# EAGLE design usb_midi_12_gate_16_cv_interface (EAGLE 8.0.0)
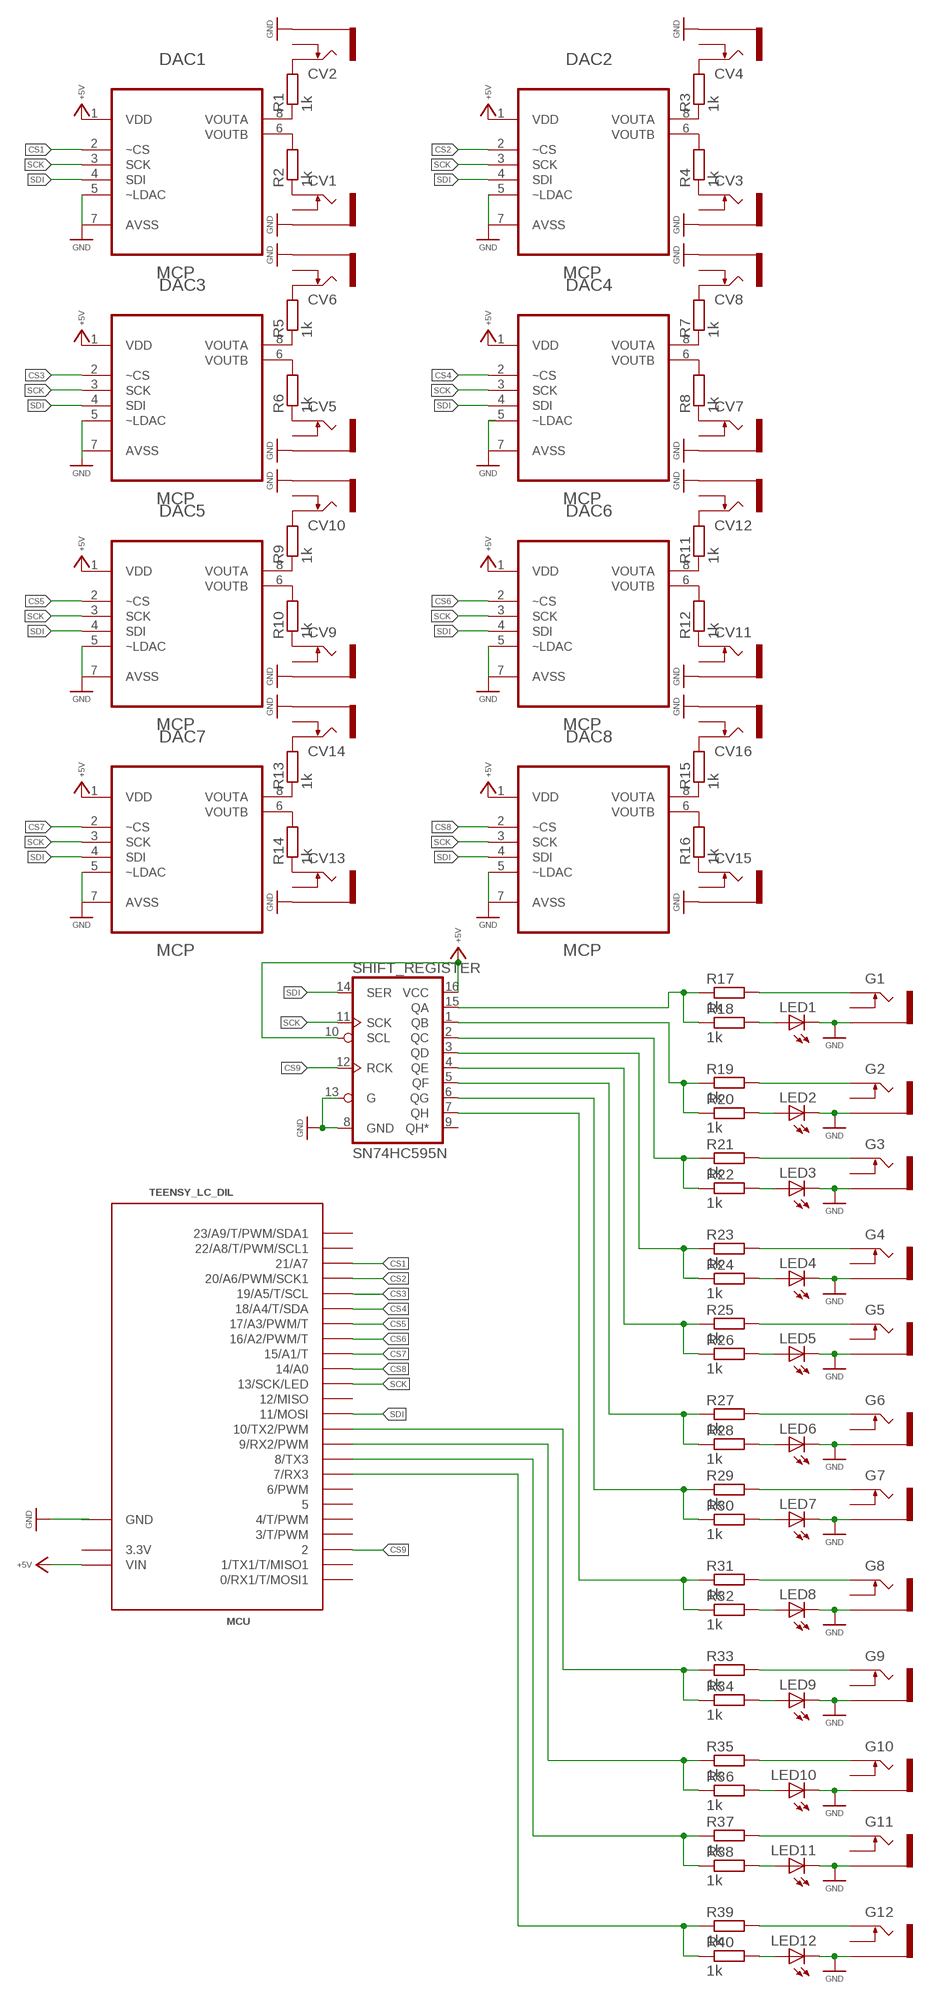
[diagram p0: schematic, sheet 1]

## Parts
CV1  THONKICONNNEW  [WQP-PJ301M-12_JACK]
CV2  THONKICONNNEW  [WQP-PJ301M-12_JACK]
CV3  THONKICONNNEW  [WQP-PJ301M-12_JACK]
CV4  THONKICONNNEW  [WQP-PJ301M-12_JACK]
CV5  THONKICONNNEW  [WQP-PJ301M-12_JACK]
CV6  THONKICONNNEW  [WQP-PJ301M-12_JACK]
CV7  THONKICONNNEW  [WQP-PJ301M-12_JACK]
CV8  THONKICONNNEW  [WQP-PJ301M-12_JACK]
CV9  THONKICONNNEW  [WQP-PJ301M-12_JACK]
CV10  THONKICONNNEW  [WQP-PJ301M-12_JACK]
CV11  THONKICONNNEW  [WQP-PJ301M-12_JACK]
CV12  THONKICONNNEW  [WQP-PJ301M-12_JACK]
CV13  THONKICONNNEW  [WQP-PJ301M-12_JACK]
CV14  THONKICONNNEW  [WQP-PJ301M-12_JACK]
CV15  THONKICONNNEW  [WQP-PJ301M-12_JACK]
CV16  THONKICONNNEW  [WQP-PJ301M-12_JACK]
DAC1  MCP  MCP4822-E/P  [DIP254P762X432-8]
DAC2  MCP  MCP4822-E/P  [DIP254P762X432-8]
DAC3  MCP  MCP4822-E/P  [DIP254P762X432-8]
DAC4  MCP  MCP4822-E/P  [DIP254P762X432-8]
DAC5  MCP  MCP4822-E/P  [DIP254P762X432-8]
DAC6  MCP  MCP4822-E/P  [DIP254P762X432-8]
DAC7  MCP  MCP4822-E/P  [DIP254P762X432-8]
DAC8  MCP  MCP4822-E/P  [DIP254P762X432-8]
G1  THONKICONNNEW  [WQP-PJ301M-12_JACK]
G2  THONKICONNNEW  [WQP-PJ301M-12_JACK]
G3  THONKICONNNEW  [WQP-PJ301M-12_JACK]
G4  THONKICONNNEW  [WQP-PJ301M-12_JACK]
G5  THONKICONNNEW  [WQP-PJ301M-12_JACK]
G6  THONKICONNNEW  [WQP-PJ301M-12_JACK]
G7  THONKICONNNEW  [WQP-PJ301M-12_JACK]
G8  THONKICONNNEW  [WQP-PJ301M-12_JACK]
G9  THONKICONNNEW  [WQP-PJ301M-12_JACK]
G10  THONKICONNNEW  [WQP-PJ301M-12_JACK]
G11  THONKICONNNEW  [WQP-PJ301M-12_JACK]
G12  THONKICONNNEW  [WQP-PJ301M-12_JACK]
LED1  LED3MM  [LED3MM]
LED2  LED3MM  [LED3MM]
LED3  LED3MM  [LED3MM]
LED4  LED3MM  [LED3MM]
LED5  LED3MM  [LED3MM]
LED6  LED3MM  [LED3MM]
LED7  LED3MM  [LED3MM]
LED8  LED3MM  [LED3MM]
LED9  LED3MM  [LED3MM]
LED10  LED3MM  [LED3MM]
LED11  LED3MM  [LED3MM]
LED12  LED3MM  [LED3MM]
MCU  TEENSY_LC_DIL  [TEENSY_3.0-3.2&LC_DIL]
R1  1k  RESISTOR10MM_RESISTOR  [10MM_RESISTOR]
R2  1k  RESISTOR10MM_RESISTOR  [10MM_RESISTOR]
R3  1k  RESISTOR10MM_RESISTOR  [10MM_RESISTOR]
R4  1k  RESISTOR10MM_RESISTOR  [10MM_RESISTOR]
R5  1k  RESISTOR10MM_RESISTOR  [10MM_RESISTOR]
R6  1k  RESISTOR10MM_RESISTOR  [10MM_RESISTOR]
R7  1k  RESISTOR10MM_RESISTOR  [10MM_RESISTOR]
R8  1k  RESISTOR10MM_RESISTOR  [10MM_RESISTOR]
R9  1k  RESISTOR10MM_RESISTOR  [10MM_RESISTOR]
R10  1k  RESISTOR10MM_RESISTOR  [10MM_RESISTOR]
R11  1k  RESISTOR10MM_RESISTOR  [10MM_RESISTOR]
R12  1k  RESISTOR10MM_RESISTOR  [10MM_RESISTOR]
R13  1k  RESISTOR10MM_RESISTOR  [10MM_RESISTOR]
R14  1k  RESISTOR10MM_RESISTOR  [10MM_RESISTOR]
R15  1k  RESISTOR10MM_RESISTOR  [10MM_RESISTOR]
R16  1k  RESISTOR10MM_RESISTOR  [10MM_RESISTOR]
R17  1k  RESISTOR10MM_RESISTOR  [10MM_RESISTOR]
R18  1k  RESISTOR10MM_RESISTOR  [10MM_RESISTOR]
R19  1k  RESISTOR10MM_RESISTOR  [10MM_RESISTOR]
R20  1k  RESISTOR10MM_RESISTOR  [10MM_RESISTOR]
R21  1k  RESISTOR10MM_RESISTOR  [10MM_RESISTOR]
R22  1k  RESISTOR10MM_RESISTOR  [10MM_RESISTOR]
R23  1k  RESISTOR10MM_RESISTOR  [10MM_RESISTOR]
R24  1k  RESISTOR10MM_RESISTOR  [10MM_RESISTOR]
R25  1k  RESISTOR10MM_RESISTOR  [10MM_RESISTOR]
R26  1k  RESISTOR10MM_RESISTOR  [10MM_RESISTOR]
R27  1k  RESISTOR10MM_RESISTOR  [10MM_RESISTOR]
R28  1k  RESISTOR10MM_RESISTOR  [10MM_RESISTOR]
R29  1k  RESISTOR10MM_RESISTOR  [10MM_RESISTOR]
R30  1k  RESISTOR10MM_RESISTOR  [10MM_RESISTOR]
R31  1k  RESISTOR10MM_RESISTOR  [10MM_RESISTOR]
R32  1k  RESISTOR10MM_RESISTOR  [10MM_RESISTOR]
R33  1k  RESISTOR10MM_RESISTOR  [10MM_RESISTOR]
R34  1k  RESISTOR10MM_RESISTOR  [10MM_RESISTOR]
R35  1k  RESISTOR10MM_RESISTOR  [10MM_RESISTOR]
R36  1k  RESISTOR10MM_RESISTOR  [10MM_RESISTOR]
R37  1k  RESISTOR10MM_RESISTOR  [10MM_RESISTOR]
R38  1k  RESISTOR10MM_RESISTOR  [10MM_RESISTOR]
R39  1k  RESISTOR10MM_RESISTOR  [10MM_RESISTOR]
R40  1k  RESISTOR10MM_RESISTOR  [10MM_RESISTOR]
SHIFT_REGISTER  SN74HC595N  74HC595N  [DIP16]

## Nets
+5V: DAC1.1(VDD) DAC2.1(VDD) DAC3.1(VDD) DAC4.1(VDD) DAC5.1(VDD) DAC6.1(VDD) DAC7.1(VDD) DAC8.1(VDD) MCU.VIN SHIFT_REGISTER.10(SCL) SHIFT_REGISTER.16(VCC)
CS1: DAC1.2(~CS) MCU.21/A7
CS2: DAC2.2(~CS) MCU.20/A6(20/A6/PWM/SCK1)
CS3: DAC3.2(~CS) MCU.19/A5(19/A5/T/SCL)
CS4: DAC4.2(~CS) MCU.18/A4(18/A4/T/SDA)
CS5: DAC5.2(~CS) MCU.17/A3(17/A3/PWM/T)
CS6: DAC6.2(~CS) MCU.16/A2(16/A2/PWM/T)
CS7: DAC7.2(~CS) MCU.15/A1(15/A1/T)
CS8: DAC8.2(~CS) MCU.14/A0
CS9: MCU.2 SHIFT_REGISTER.12(RCK)
GND: CV1.P$3_SLEEVE(SLEEVE) CV2.P$3_SLEEVE(SLEEVE) CV3.P$3_SLEEVE(SLEEVE) CV4.P$3_SLEEVE(SLEEVE) CV5.P$3_SLEEVE(SLEEVE) CV6.P$3_SLEEVE(SLEEVE) CV7.P$3_SLEEVE(SLEEVE) CV8.P$3_SLEEVE(SLEEVE) CV9.P$3_SLEEVE(SLEEVE) CV10.P$3_SLEEVE(SLEEVE) CV11.P$3_SLEEVE(SLEEVE) CV12.P$3_SLEEVE(SLEEVE) CV13.P$3_SLEEVE(SLEEVE) CV14.P$3_SLEEVE(SLEEVE) CV15.P$3_SLEEVE(SLEEVE) CV16.P$3_SLEEVE(SLEEVE) DAC1.5(~LDAC) DAC1.7(AVSS) DAC2.5(~LDAC) DAC2.7(AVSS) DAC3.7(AVSS) DAC4.7(AVSS) DAC5.5(~LDAC) DAC5.7(AVSS) DAC6.5(~LDAC) DAC6.7(AVSS) DAC7.5(~LDAC) DAC7.7(AVSS) DAC8.5(~LDAC) DAC8.7(AVSS) G1.P$3_SLEEVE(SLEEVE) G2.P$3_SLEEVE(SLEEVE) G3.P$3_SLEEVE(SLEEVE) G4.P$3_SLEEVE(SLEEVE) G5.P$3_SLEEVE(SLEEVE) G6.P$3_SLEEVE(SLEEVE) G7.P$3_SLEEVE(SLEEVE) G8.P$3_SLEEVE(SLEEVE) G9.P$3_SLEEVE(SLEEVE) G10.P$3_SLEEVE(SLEEVE) G11.P$3_SLEEVE(SLEEVE) G12.P$3_SLEEVE(SLEEVE) LED1.K(C) LED2.K(C) LED3.K(C) LED4.K(C) LED5.K(C) LED6.K(C) LED7.K(C) LED8.K(C) LED9.K(C) LED10.K(C) LED11.K(C) LED12.K(C) SHIFT_REGISTER.8(GND) SHIFT_REGISTER.13(G)
N$1: DAC1.6(VOUTB) R2.2
N$2: DAC1.8(VOUTA) R1.1
N$3: DAC2.8(VOUTA) R3.1
N$4: DAC2.6(VOUTB) R4.2
N$5: DAC3.8(VOUTA) R5.1
N$6: DAC3.6(VOUTB) R6.2
N$7: DAC4.8(VOUTA) R7.1
N$8: DAC4.6(VOUTB) R8.2
N$9: DAC5.8(VOUTA) R9.1
N$10: DAC5.6(VOUTB) R10.2
N$11: DAC6.8(VOUTA) R11.1
N$12: DAC6.6(VOUTB) R12.2
N$13: DAC7.8(VOUTA) R13.1
N$14: DAC7.6(VOUTB) R14.2
N$15: DAC8.8(VOUTA) R15.1
N$16: DAC8.6(VOUTB) R16.2
N$17: CV1.P$1_TIP(TIP) R2.1
N$18: CV2.P$1_TIP(TIP) R1.2
N$19: CV4.P$1_TIP(TIP) R3.2
N$20: CV3.P$1_TIP(TIP) R4.1
N$21: CV5.P$1_TIP(TIP) R6.1
N$22: CV6.P$1_TIP(TIP) R5.2
N$23: CV7.P$1_TIP(TIP) R8.1
N$24: CV8.P$1_TIP(TIP) R7.2
N$25: CV9.P$1_TIP(TIP) R10.1
N$26: CV10.P$1_TIP(TIP) R9.2
N$27: CV11.P$1_TIP(TIP) R12.1
N$28: CV12.P$1_TIP(TIP) R11.2
N$29: CV13.P$1_TIP(TIP) R14.1
N$30: CV14.P$1_TIP(TIP) R13.2
N$31: CV15.P$1_TIP(TIP) R16.1
N$32: CV16.P$1_TIP(TIP) R15.2
N$33: G9.P$1_TIP(TIP) R33.2
N$34: LED9.A R34.2
N$35: MCU.10(10/TX2/PWM) R33.1 R34.1
N$36: G10.P$1_TIP(TIP) R35.2
N$37: LED10.A R36.2
N$38: MCU.9(9/RX2/PWM) R35.1 R36.1
N$39: G11.P$1_TIP(TIP) R37.2
N$40: LED11.A R38.2
N$41: MCU.8(8/TX3) R37.1 R38.1
N$42: G12.P$1_TIP(TIP) R39.2
N$43: LED12.A R40.2
N$44: MCU.7(7/RX3) R39.1 R40.1
N$57: G1.P$1_TIP(TIP) R17.2
N$58: R17.1 R18.1 SHIFT_REGISTER.15(QA)
N$59: LED1.A R18.2
N$60: G2.P$1_TIP(TIP) R19.2
N$61: LED2.A R20.2
N$62: R19.1 R20.1 SHIFT_REGISTER.1(QB)
N$63: G3.P$1_TIP(TIP) R21.2
N$64: LED3.A R22.2
N$65: R21.1 R22.1 SHIFT_REGISTER.2(QC)
N$66: G4.P$1_TIP(TIP) R23.2
N$67: LED4.A R24.2
N$68: R23.1 R24.1 SHIFT_REGISTER.3(QD)
N$69: G5.P$1_TIP(TIP) R25.2
N$70: LED5.A R26.2
N$71: R25.1 R26.1 SHIFT_REGISTER.4(QE)
N$72: G6.P$1_TIP(TIP) R27.2
N$73: LED6.A R28.2
N$74: R27.1 R28.1 SHIFT_REGISTER.5(QF)
N$75: G7.P$1_TIP(TIP) R29.2
N$76: LED7.A R30.2
N$77: R29.1 R30.1 SHIFT_REGISTER.6(QG)
N$78: G8.P$1_TIP(TIP) R31.2
N$79: LED8.A R32.2
N$80: R31.1 R32.1 SHIFT_REGISTER.7(QH)
N$83: DAC3.5(~LDAC)
SCK: DAC1.3(SCK) DAC2.3(SCK) DAC3.3(SCK) DAC4.3(SCK) DAC5.3(SCK) DAC6.3(SCK) DAC7.3(SCK) DAC8.3(SCK) MCU.13(13/SCK/LED) SHIFT_REGISTER.11(SCK)
SDI: DAC1.4(SDI) DAC2.4(SDI) DAC3.4(SDI) DAC4.4(SDI) DAC5.4(SDI) DAC6.4(SDI) DAC7.4(SDI) DAC8.4(SDI) MCU.11(11/MOSI) SHIFT_REGISTER.14(SER)
Unconnected: CV1.P$2_SWITCH(SWITCH) CV2.P$2_SWITCH(SWITCH) CV3.P$2_SWITCH(SWITCH) CV4.P$2_SWITCH(SWITCH) CV5.P$2_SWITCH(SWITCH) CV6.P$2_SWITCH(SWITCH) CV7.P$2_SWITCH(SWITCH) CV8.P$2_SWITCH(SWITCH) CV9.P$2_SWITCH(SWITCH) CV10.P$2_SWITCH(SWITCH) CV11.P$2_SWITCH(SWITCH) CV12.P$2_SWITCH(SWITCH) CV13.P$2_SWITCH(SWITCH) CV14.P$2_SWITCH(SWITCH) CV15.P$2_SWITCH(SWITCH) CV16.P$2_SWITCH(SWITCH) DAC4.5(~LDAC) G1.P$2_SWITCH(SWITCH) G2.P$2_SWITCH(SWITCH) G3.P$2_SWITCH(SWITCH) G4.P$2_SWITCH(SWITCH) G5.P$2_SWITCH(SWITCH) G6.P$2_SWITCH(SWITCH) G7.P$2_SWITCH(SWITCH) G8.P$2_SWITCH(SWITCH) G9.P$2_SWITCH(SWITCH) G10.P$2_SWITCH(SWITCH) G11.P$2_SWITCH(SWITCH) G12.P$2_SWITCH(SWITCH) MCU.0(0/RX1/T/MOSI1) MCU.1(1/TX1/T/MISO1) MCU.3(3/T/PWM) MCU.4(4/T/PWM) MCU.5 MCU.6(6/PWM) MCU.12(12/MISO) MCU.22/A8(22/A8/T/PWM/SCL1) MCU.23/A9(23/A9/T/PWM/SDA1) SHIFT_REGISTER.9(QH*)

## Power pins joined to a net without a drawn wire
3.3V: MCU.3.3V
GND: MCU.AGND(GND) MCU.GND

## Library data of the parts
CV1-CV16 G1-G12 = MusicThingModular:THONKICONN: 3.5mm socket for Eurorack modular synths
DAC1-DAC8 = Microchip_By_element14_Batch_1:MCP4822-E/P: DAC; MPN: MCP4822-E/P; OC_FARNELL: 1439413; OC_NEWARK: 11M1705; PACKAGE: DIP-8; SUPPLIER: Microchip
LED1-LED12 = led:LED: LED OSRAM: - CHIPLED LG R971, LG N971, LY N971, LG Q971, LY Q971, LO R971, LY R971 LH N974, LH R974 LS Q976, LO Q976, LY Q976 LO Q996 - Hyper CHIPLED LW Q18S LB Q993, LB Q99A, LB R99A - SideLED LS A670, LO A670, LY A670, LG A670, LP A670 LB A673, LV A673, LT A673, LW A673 LH A674 LY A675 LS A676, LA A676, LO A676, LY A676, LW A676 LS A679, LY A679, LG A679 - Hyper Micro SIDELED® LS Y876, LA Y876, LO Y876, LY Y876 LT Y87S - SmartLED LW L88C, LW L88S LB L89C, LB L89S, LG L890 LS L89K, LO L89K, LY L89K LS L896, LA L896, LO L896, LY L896 - TOPLED LS T670, LO T670, LY T670, LG T670, LP T670 LSG T670, LSP T670, LSY T670, LOP T670, LYG T670 LG T671, LOG T671, LSG T671 LB T673, LV T673, LT T673, LW T673 LH T674 LS T676, LA T676, LO T676, LY T676, LB T676, LH T676, LSB T676, LW T676 LB T67C, LV T67C, LT T67C, LS T67K, LO T67K, LY T67K, LW E67C LS E67B, LA E67B, LO E67B, LY E67B, LB E67C, LV E67C, LT E67C LW T67C LS T679, LY T679, LG T679 LS T770, LO T770, LY T770, LG T770, LP T770 LB T773, LV T773, LT T773, LW T773 LH T774 LS E675, LA E675, LY E675, LS T675 LS T776, LA T776, LO T776, LY T776, LB T776 LHGB T686 LT T68C, LB T68C - Hyper Mini TOPLED® LB M676 - Mini TOPLED Santana® LG M470 LS M47K, LO M47K, LY M47K Source: http://www.osram.convergy.de LUXEON: - LUMILED® LXK2-PW12-R00, LXK2-PW12-S00, LXK2-PW14-U00, LXK2-PW14-V00 LXK2-PM12-R00, LXK2-PM12-S00, LXK2-PM14-U00 LXK2-PE12-Q00, LXK2-PE12-R00, LXK2-PE12-S00, LXK2-PE14-T00, LXK2-PE14-U00 LXK2-PB12-K00, LXK2-PB12-L00, LXK2-PB12-M00, LXK2-PB14-N00, LXK2-PB14-P00, LXK2-PB14-Q00 LXK2-PR12-L00, LXK2-PR12-M00, LXK2-PR14-Q00, LXK2-PR14-R00 LXK2-PD12-Q00, LXK2-PD12-R00, LXK2-PD12-S00 LXK2-PH12-R00, LXK2-PH12-S00 LXK2-PL12-P00, LXK2-PL12-Q00, LXK2-PL12-R00 Source: www.luxeon.com KINGBRIGHT: KA-3528ASYC Source: www.kingbright.com
MCU = Teensy_3_and_LC_Series_Boards_v1.4:TEENSY_LC_DIL
R1-R40 = MusicThingModular:RESISTOR: Standard resistor, various versions
SHIFT_REGISTER = SparkFun-IC-Logic:74*595: 8-Bit Shift Register (Serial to Parallel) Datasheet <http://cdn.sparkfun.com/datasheets/BreakoutBoards/MM74HC595.pdf> SparkFun Products SparkFun Shift Register Breakout - 74HC595 <https://www.sparkfun.com/products/10680> (BOB-10680); PROD_ID: IC-13123

## Board
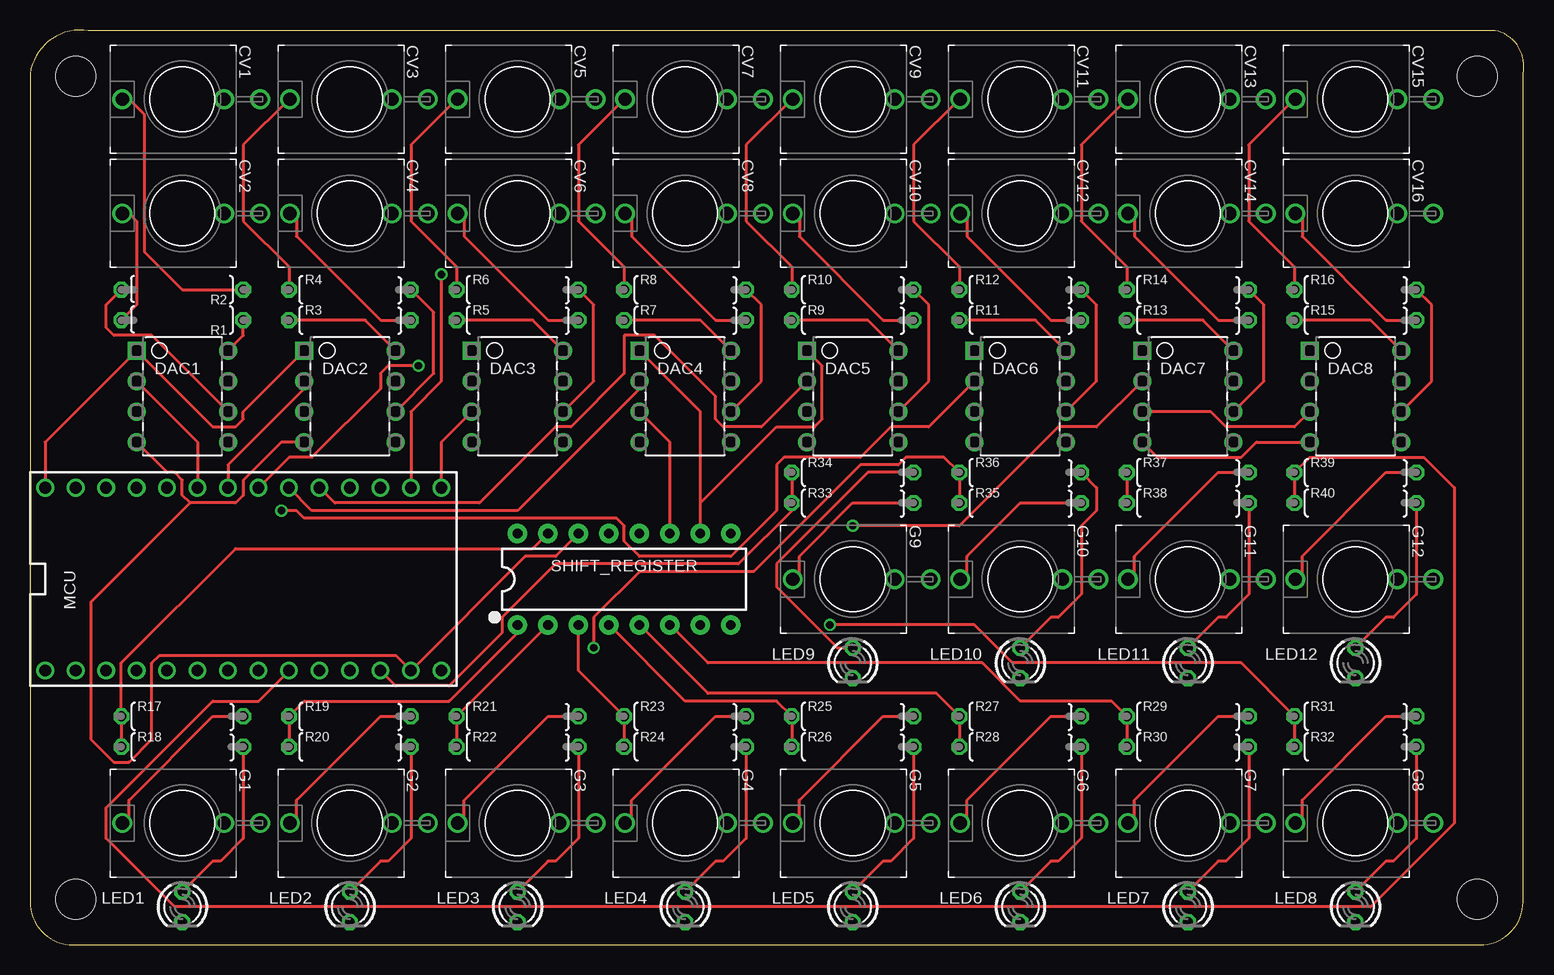
[diagram p1: board, top side]
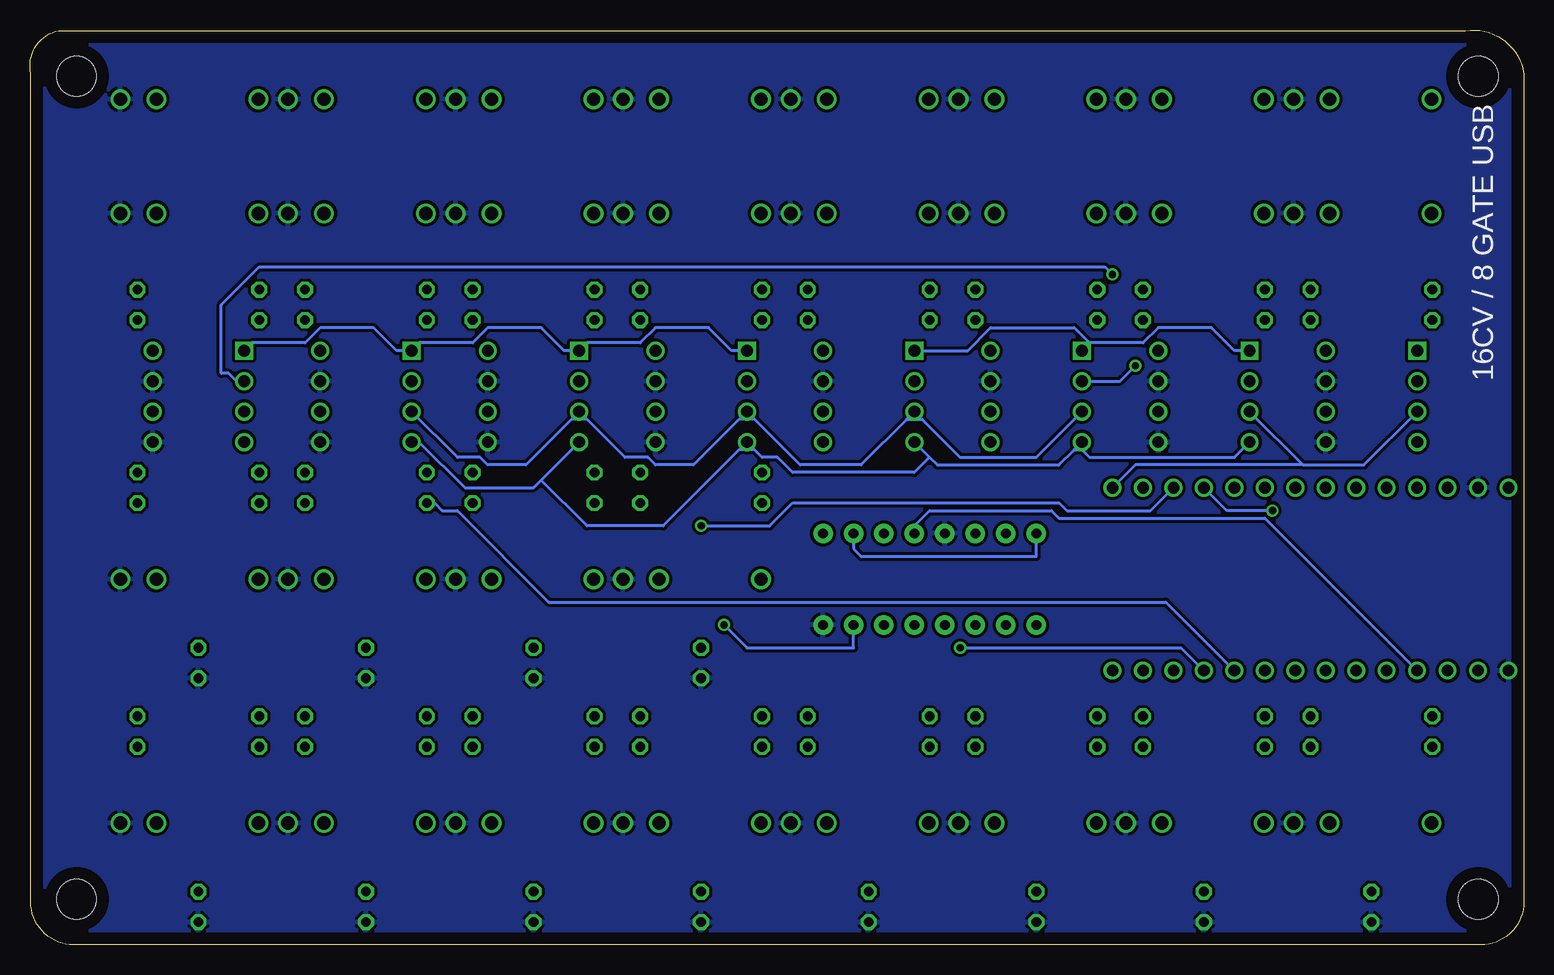
[diagram p2: board, bottom side, seen from below]

Size 124.53 x 76.24 mm. Coordinates in mm from the lower left corner, seen from the top.
Outline: 0,72.61 0,3.59 arc90 3.59,0 120.87,0 arc90 124.46,3.59 124.46,72.61 arc90 122.14,76.2 4.86,76.2 arc90 0,72.61
Copper layers (1*16): Top 0.035mm / dielectric 1.5mm / Bottom 0.035mm
Design rules "default": minimum track width 10mil, minimum drill 24mil, track to track 8mil, track to pad 8mil, pad to pad 8mil, via to via 8mil, smd to smd 8mil, copper to edge 40mil, drill to drill 8mil, minimum pad ring 10mil, minimum via ring 8mil, stop-mask expansion 4mil, vias tented up to drill 0mil, thermal gap 10mil
Holes 3.3 mm at 3.81,72.39 120.65,72.39 3.81,3.81 120.65,3.81

### Footprints (pad centres in the part's own frame; a part is rotated, then mirrored left to right if it is on the bottom)
WQP-PJ301M-12_JACK = drill 1.1: P$1_TIP 0,5; P$2_SWITCH 0,-3.5; P$3_SLEEVE 0,-6.5
DIP254P762X432-8 = drill 0.991 square: 1 -7.62,7.62 | drill 0.991: 2 -7.62,5.08; 3 -7.62,2.54; 4 -7.62,0; 5 0,0; 6 0,2.54; 7 0,5.08; 8 0,7.62
LED3MM = drill 0.813 octagon: A -1.27,0; K 1.27,0
TEENSY_3.0-3.2&LC_DIL = drill 0.965: 0 -7.62,13.97; 1 -7.62,11.43; 2 -7.62,8.89; 3 -7.62,6.35; 3.3V 7.62,11.43; 4 -7.62,3.81; 5 -7.62,1.27; 6 -7.62,-1.27; 7 -7.62,-3.81; 8 -7.62,-6.35; 9 -7.62,-8.89; 10 -7.62,-11.43; 11 -7.62,-13.97; 12 -7.62,-16.51; 13 7.62,-16.51; 14/A0 7.62,-13.97; 15/A1 7.62,-11.43; 16/A2 7.62,-8.89; 17/A3 7.62,-6.35; 18/A4 7.62,-3.81; 19/A5 7.62,-1.27; 20/A6 7.62,1.27; 21/A7 7.62,3.81; 22/A8 7.62,6.35; 23/A9 7.62,8.89; AGND 7.62,13.97; GND -7.62,16.51; VIN 7.62,16.51
10MM_RESISTOR = drill 0.813 octagon: 1 -5.08,0; 2 5.08,0
DIP16 = drill 0.813 pad 1.626: 1 -8.89,-3.81; 2 -6.35,-3.81; 3 -3.81,-3.81; 4 -1.27,-3.81; 5 1.27,-3.81; 6 3.81,-3.81; 7 6.35,-3.81; 8 8.89,-3.81; 9 8.89,3.81; 10 6.35,3.81; 11 3.81,3.81; 12 1.27,3.81; 13 -1.27,3.81; 14 -3.81,3.81; 15 -6.35,3.81; 16 -8.89,3.81

### Placement (x,y rotation side)
CV1  12.7,70.48 90 top
CV2  12.7,60.96 90 top
CV3  26.67,70.48 90 top
CV4  26.67,60.96 90 top
CV5  40.64,70.48 90 top
CV6  40.64,60.96 90 top
CV7  54.61,70.48 90 top
CV8  54.61,60.96 90 top
CV9  68.58,70.48 90 top
CV10  68.58,60.96 90 top
CV11  82.55,70.48 90 top
CV12  82.55,60.96 90 top
CV13  96.52,70.48 90 top
CV14  96.52,60.96 90 top
CV15  110.49,70.48 90 top
CV16  110.49,60.96 90 top
DAC1  16.51,41.91 0 top
DAC2  30.48,41.91 0 top
DAC3  44.45,41.91 0 top
DAC4  58.42,41.91 0 top
DAC5  72.39,41.91 0 top
DAC6  86.36,41.91 0 top
DAC7  100.33,41.91 0 top
DAC8  114.3,41.91 0 top
G1  12.7,10.16 90 top
G2  26.67,10.16 90 top
G3  40.64,10.16 90 top
G4  54.61,10.16 90 top
G5  68.58,10.16 90 top
G6  82.55,10.16 90 top
G7  96.52,10.16 90 top
G8  110.49,10.16 90 top
G9  68.58,30.48 90 top
G10  82.55,30.48 90 top
G11  96.52,30.48 90 top
G12  110.49,30.48 90 top
LED1  12.7,3.17 270 top
LED2  26.67,3.17 270 top
LED3  40.64,3.17 270 top
LED4  54.61,3.17 270 top
LED5  68.58,3.17 270 top
LED6  82.55,3.17 270 top
LED7  96.52,3.17 270 top
LED8  110.49,3.17 270 top
LED9  68.58,23.5 270 top
LED10  82.55,23.5 270 top
LED11  96.52,23.5 270 top
LED12  110.49,23.5 270 top
MCU  17.78,30.48 90 top
R1  12.7,52.07 180 top
R2  12.7,54.61 180 top
R3  26.67,52.07 0 top
R4  26.67,54.61 0 top
R5  40.64,52.07 0 top
R6  40.64,54.61 0 top
R7  54.61,52.07 0 top
R8  54.61,54.61 0 top
R9  68.58,52.07 0 top
R10  68.58,54.61 0 top
R11  82.55,52.07 0 top
R12  82.55,54.61 0 top
R13  96.52,52.07 0 top
R14  96.52,54.61 0 top
R15  110.49,52.07 0 top
R16  110.49,54.61 0 top
R17  12.7,19.05 0 top
R18  12.7,16.51 0 top
R19  26.67,19.05 0 top
R20  26.67,16.51 0 top
R21  40.64,19.05 0 top
R22  40.64,16.51 0 top
R23  54.61,19.05 0 top
R24  54.61,16.51 0 top
R25  68.58,19.05 0 top
R26  68.58,16.51 0 top
R27  82.55,19.05 0 top
R28  82.55,16.51 0 top
R29  96.52,19.05 0 top
R30  96.52,16.51 0 top
R31  110.49,19.05 0 top
R32  110.49,16.51 0 top
R33  68.58,36.83 0 top
R34  68.58,39.37 0 top
R35  82.55,36.83 0 top
R36  82.55,39.37 0 top
R37  96.52,39.37 0 top
R38  96.52,36.83 0 top
R39  110.49,39.37 0 top
R40  110.49,36.83 0 top
SHIFT_REGISTER  49.53,30.48 0 top

### Tracks (layer width: path | path; a pad name or v marks a point on that pad's centre or on a via)
+5V
  Top 0.254: MCU.VIN 1.27,41.91 DAC1.1 15.24,43.18 17.14,43.18 17.78,43.81 17.78,44.45 DAC2.1 | DAC4.1 55.88,44.45 55.88,36.83 | SHIFT_REGISTER.10 55.88,36.83 | DAC5.1 66.04,48.26 66.04,43.81 65.41,43.18 62.23,43.18 55.88,36.83
  Bottom 0.254: 36.2,50.16 31.75,50.16 30.48,51.44 26.04,51.44 24.13,49.53 DAC2.1 | DAC5.1 66.04,49.53 67.94,51.44 72.39,51.44 73.66,50.16 78.11,50.16 DAC6.1 80.01,49.53 81.92,51.44 86.36,51.44 87.63,50.16 92.08,50.16 DAC7.1 93.98,49.53 95.89,51.44 100.33,51.44 101.6,50.16 106.05,50.16 DAC8.1 | SHIFT_REGISTER.16 40.64,32.38 55.24,32.38 55.88,33.02 SHIFT_REGISTER.10 | 36.2,50.16 37.47,51.44 44.45,51.44 46.35,49.53 DAC4.1 | 36.2,50.16 DAC3.1
CS1
  Top 0.254: MCU.21/A7 13.97,41.91 DAC1.2
CS2
  Top 0.254: MCU.20/A6 16.51,40.01 22.86,46.35 DAC2.2
CS3  (via drill 0.61)
  Top 0.254: MCU.19/A5 21.59,40.64 23.5,40.64 29.21,46.35 29.21,47.62 29.84,48.26 v32.38,48.26
  Bottom 0.254: v32.38,48.26 33.66,46.99 DAC3.2
CS4
  Top 0.254: MCU.18/A4 23.5,36.2 40.64,36.2 50.8,46.35 DAC4.2
CS5
  Top 0.254: MCU.17/A3 25.4,36.83 37.47,36.83 43.81,43.18 45.09,43.18 49.53,47.62 49.53,50.8 52.07,50.8 57.15,45.72 57.15,43.81 57.78,43.18 60.96,43.18 DAC5.2
CS6  (via drill 0.61)
  Top 0.254: v20.95,36.2 22.23,36.2 22.86,35.56 48.9,35.56 49.53,34.92 49.53,33.66 50.8,32.38 58.42,32.38 62.23,36.2 62.23,40.01 62.87,40.64 69.22,40.64 71.75,43.18 74.93,43.18 DAC6.2
  Bottom 0.254: MCU.16/A2 24.77,36.2 v20.95,36.2
CS7  (via drill 0.61)
  Top 0.254: v68.58,34.92 77.47,34.92 85.72,43.18 88.9,43.18 DAC7.2
  Bottom 0.254: MCU.15/A1 31.11,36.2 38.1,36.2 38.73,36.83 60.96,36.83 62.87,34.92 v68.58,34.92
CS8  (via drill 0.61)
  Top 0.254: MCU.14/A0 31.75,44.45 34.29,46.99 v34.29,55.88
  Bottom 0.254: v34.29,55.88 34.92,56.52 105.41,56.52 108.58,53.34 108.58,47.62 107.95,47.62 107.31,46.99 DAC8.2
CS9
  Bottom 0.254: MCU.2 21.59,35.56 38.73,35.56 39.37,36.2 49.53,36.2 50.8,34.92 SHIFT_REGISTER.12
GND
  pour Bottom (isolate 0.254): -1.27,76.2 125.73,76.2 125.73,-1.27 -1.27,-1.27
N$1
  Top 0.254: R2.2 6.35,53.34 6.35,51.44 6.99,50.8 10.16,50.8 DAC1.6
N$2
  Top 0.254: R1.1 17.78,50.8 DAC1.8
N$3
  Top 0.254: R3.1 27.94,52.07 DAC2.8
N$4
  Top 0.254: R4.2 33.66,52.7 33.66,47.62 DAC2.6
N$5
  Top 0.254: R5.1 41.91,52.07 DAC3.8
N$6
  Top 0.254: R6.2 46.99,53.34 46.99,46.99 DAC3.6
N$7
  Top 0.254: R7.1 55.88,52.07 DAC4.8
N$8
  Top 0.254: R8.2 60.96,53.34 60.96,46.99 DAC4.6
N$9
  Top 0.254: R9.1 69.85,52.07 DAC5.8
N$10
  Top 0.254: R10.2 74.93,53.34 74.93,46.99 DAC5.6
N$11
  Top 0.254: R11.1 83.82,52.07 DAC6.8
N$12
  Top 0.254: R12.2 88.9,53.34 88.9,46.99 DAC6.6
N$13
  Top 0.254: R13.1 97.79,52.07 DAC7.8
N$14
  Top 0.254: R14.2 102.87,53.34 102.87,46.99 DAC7.6
N$15
  Top 0.254: R15.1 111.76,52.07 DAC8.8
N$16
  Top 0.254: R16.2 116.84,53.34 116.84,46.99 DAC8.6
N$17
  Top 0.254: R2.1 12.7,54.61 9.53,57.78 9.53,69.22 8.26,70.48 CV1.P$1_TIP
N$18
  Top 0.254: R1.2 8.89,53.34 8.89,60.33 8.26,60.96 CV2.P$1_TIP
N$19
  Top 0.254: R3.2 29.21,52.07 22.23,59.05 22.23,60.96 CV4.P$1_TIP
N$20
  Top 0.254: R4.1 21.59,56.52 17.78,60.33 17.78,66.67 21.59,70.48 CV3.P$1_TIP
N$21
  Top 0.254: R6.1 35.56,56.52 31.75,60.33 31.75,66.67 35.56,70.48 CV5.P$1_TIP
N$22
  Top 0.254: R5.2 43.18,52.07 36.2,59.05 36.2,60.96 CV6.P$1_TIP
N$23
  Top 0.254: R8.1 49.53,56.52 45.72,60.33 45.72,66.67 49.53,70.48 CV7.P$1_TIP
N$24
  Top 0.254: R7.2 57.15,52.07 50.16,59.05 50.16,60.96 CV8.P$1_TIP
N$25
  Top 0.254: R10.1 63.5,56.52 59.69,60.33 59.69,66.67 63.5,70.48 CV9.P$1_TIP
N$26
  Top 0.254: R9.2 71.12,52.07 64.14,59.05 64.14,60.96 CV10.P$1_TIP
N$27
  Top 0.254: R12.1 77.47,56.52 73.66,60.33 73.66,66.67 77.47,70.48 CV11.P$1_TIP
N$28
  Top 0.254: R11.2 85.09,52.07 78.11,59.05 78.11,60.96 CV12.P$1_TIP
N$29
  Top 0.254: R14.1 91.44,56.52 87.63,60.33 87.63,66.67 91.44,70.48 CV13.P$1_TIP
N$30
  Top 0.254: R13.2 99.06,52.07 92.08,59.05 92.08,60.96 CV14.P$1_TIP
N$31
  Top 0.254: R16.1 105.41,56.52 101.6,60.33 101.6,66.67 105.41,70.48 CV15.P$1_TIP
N$32
  Top 0.254: R15.2 113.03,52.07 106.05,59.05 106.05,60.96 CV16.P$1_TIP
N$33
  Top 0.254: R33.2 68.58,36.83 64.14,32.38 64.14,30.48 G9.P$1_TIP
N$34
  Top 0.254: LED9.A 67.31,24.77 62.23,29.84 62.23,31.75 69.85,39.37 R34.2
N$35
  Top 0.254: R34.1 R33.1 63.5,36.2 59.05,31.75 43.81,31.75 39.37,27.3 39.37,26.04 34.92,21.59 30.48,21.59 MCU.10
N$36
  Top 0.254: R35.2 82.55,36.83 78.11,32.38 78.11,30.48 G10.P$1_TIP
N$37
  Top 0.254: LED10.A 85.09,27.3 85.72,27.3 87.63,29.21 87.63,34.92 88.9,36.2 88.9,38.1 R36.2
N$38  (via drill 0.61)
  Top 0.254: R35.1 R36.1 76.2,40.64 73.03,40.64 72.39,40.01 69.22,40.01 60.33,31.11 50.8,31.11 46.99,27.3 v46.99,24.77
  Bottom 0.254: MCU.9 28.57,24.77 v46.99,24.77
N$39
  Top 0.254: R37.2 99.06,39.37 92.08,32.38 92.08,30.48 G11.P$1_TIP
N$40
  Top 0.254: LED11.A 99.06,27.3 99.69,27.3 101.6,29.21 R38.2
N$41
  Top 0.254: R37.1 R38.1
  Bottom 0.254: MCU.8 29.84,28.57 81.28,28.57 88.9,36.2 90.17,36.2 90.81,36.83 R38.1
N$42
  Top 0.254: R39.2 113.03,39.37 106.05,32.38 106.05,30.48 G12.P$1_TIP
N$43
  Top 0.254: LED12.A 113.03,27.3 113.67,27.3 115.57,29.21 R40.2
N$44
  Top 0.254: R40.1 R39.1 106.68,40.64 116.2,40.64 118.75,38.1 118.75,10.16 111.76,3.17 12.06,3.17 6.35,8.89 6.35,11.43 15.24,20.32 19.05,20.32 MCU.7
N$57
  Top 0.254: R17.2 15.24,19.05 8.26,12.06 8.26,10.16 G1.P$1_TIP
N$58
  Top 0.254: R18.1 R17.1 7.62,23.5 17.14,33.02 41.91,33.02 SHIFT_REGISTER.15
N$59
  Top 0.254: LED1.A 15.24,6.99 15.88,6.99 17.78,8.89 R18.2
N$60
  Top 0.254: R19.2 29.21,19.05 22.23,12.06 22.23,10.16 G2.P$1_TIP
N$61
  Top 0.254: LED2.A 29.21,6.99 29.84,6.99 31.75,8.89 R20.2
N$62
  Top 0.254: R20.1 R19.1 22.86,20.32 34.92,20.32 40.64,26.04 SHIFT_REGISTER.1
N$63
  Top 0.254: R21.2 43.18,19.05 36.2,12.06 36.2,10.16 G3.P$1_TIP
N$64
  Top 0.254: LED3.A 43.18,6.99 43.81,6.99 45.72,8.89 R22.2
N$65
  Top 0.254: R22.1 R21.1 SHIFT_REGISTER.2
N$66
  Top 0.254: R23.2 57.15,19.05 50.16,12.06 50.16,10.16 G4.P$1_TIP
N$67
  Top 0.254: LED4.A 57.15,6.99 57.78,6.99 59.69,8.89 R24.2
N$68
  Top 0.254: R24.1 R23.1 45.72,22.86 SHIFT_REGISTER.3
N$69
  Top 0.254: R25.2 71.12,19.05 64.14,12.06 64.14,10.16 G5.P$1_TIP
N$70
  Top 0.254: LED5.A 71.12,6.99 71.75,6.99 73.66,8.89 R26.2
N$71
  Top 0.254: R26.1 R25.1 62.23,20.32 54.61,20.32 SHIFT_REGISTER.4
N$72
  Top 0.254: R27.2 85.09,19.05 78.11,12.06 78.11,10.16 G6.P$1_TIP
N$73
  Top 0.254: LED6.A 85.09,6.99 85.72,6.99 87.63,8.89 R28.2
N$74
  Top 0.254: R28.1 R27.1 75.56,20.95 56.52,20.95 SHIFT_REGISTER.5
N$75
  Top 0.254: R29.2 99.06,19.05 92.08,12.06 92.08,10.16 G7.P$1_TIP
N$76
  Top 0.254: LED7.A 99.06,6.99 99.69,6.99 101.6,8.89 R30.2
N$77
  Top 0.254: R30.1 R29.1 90.17,20.32 82.55,20.32 79.38,23.5 56.52,23.5 SHIFT_REGISTER.6
N$78
  Top 0.254: R31.2 113.03,19.05 106.05,12.06 106.05,10.16 G8.P$1_TIP
N$79
  Top 0.254: LED8.A 113.03,6.99 113.67,6.99 115.57,8.89 R32.2
N$80  (via drill 0.61)
  Top 0.254: R32.1 R31.1 100.97,23.5 81.92,23.5 78.74,26.67 v66.67,26.67
  Bottom 0.254: SHIFT_REGISTER.7 55.88,24.77 64.77,24.77 v66.67,26.67
SCK
  Top 0.254: MCU.13 34.29,41.91 DAC3.3 | DAC7.3 98.42,44.45 99.69,43.18 105.41,43.18 DAC8.3 | DAC4.3 53.34,41.91 SHIFT_REGISTER.11
  Bottom 0.254: DAC1.3 13.34,40.01 18.41,40.01 | DAC2.3 18.41,40.01 | MCU.13 32.38,40.01 18.41,40.01 | 64.14,43.81 60.33,40.01 55.24,40.01 51.44,43.81 | 64.14,43.81 DAC5.3 | DAC4.3 51.44,43.81 | 78.11,43.81 74.93,40.64 73.03,40.64 72.39,40.01 69.22,40.01 65.41,43.81 64.14,43.81 | 78.11,43.81 DAC6.3 | DAC7.3 88.9,40.64 87,40.64 86.36,40.01 83.19,40.01 79.38,43.81 78.11,43.81 | DAC3.3 40.64,40.64 46.99,40.64 50.16,43.81 51.44,43.81
SDI
  Top 0.254: DAC8.4 102.23,41.91 100.97,40.64 93.98,40.64 DAC7.4 | SHIFT_REGISTER.14 43.81,32.38 41.27,32.38 MCU.11 30.48,24.13 10.79,24.13 10.16,23.5 10.16,17.14 8.26,15.24 6.99,15.24 5.08,17.14 5.08,28.57 13.34,36.83 | DAC1.4 11.43,39.37 12.06,39.37 12.7,38.73 12.7,37.47 13.34,36.83 | 13.34,36.83 17.14,36.83 17.78,37.47 17.78,38.73 20.95,41.91 DAC2.4
  Bottom 0.254: 81.92,38.73 82.55,38.1 88.27,38.1 92.08,41.91 DAC7.4 | 81.92,38.73 DAC6.4 | 37.47,41.27 38.73,40.01 48.9,40.01 49.53,40.64 | 37.47,41.27 DAC3.4 | DAC4.4 49.53,40.64 | 64.14,41.27 63.5,40.64 62.23,40.64 60.96,39.37 50.8,39.37 49.53,40.64 | 64.14,41.27 DAC5.4 | DAC2.4 24.13,40.64 36.2,40.64 36.83,41.27 37.47,41.27 | 81.92,38.73 78.11,34.92 71.75,34.92 65.41,41.27 64.14,41.27

### Text on the board
bNames: 16CV / 8 GATE USB